# EAGLE design knobby (EAGLE 6.5.0)
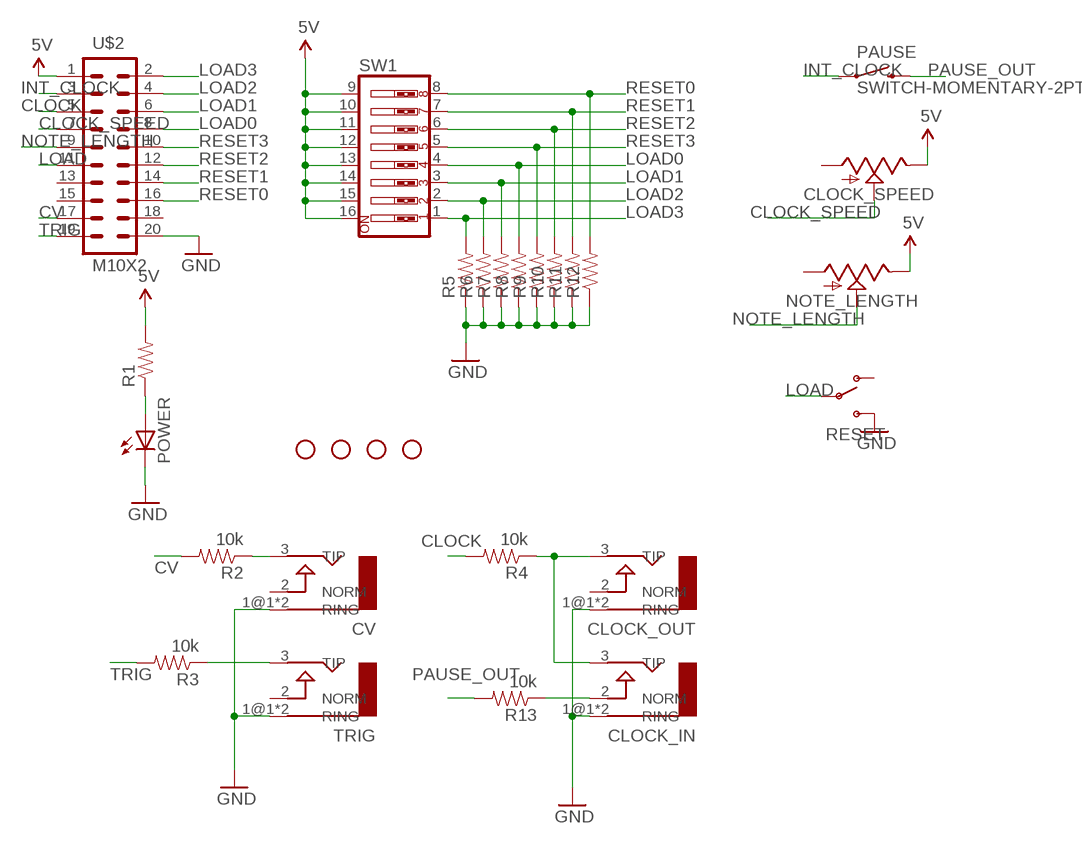
[diagram p0: schematic, sheet 1]

## Parts
CLOCK_IN  AUDIO-JACKERTHENVAR  [ERTHENVAR-JACK]
CLOCK_OUT  AUDIO-JACKERTHENVAR  [ERTHENVAR-JACK]
CLOCK_SPEED  SPARKFUN_POTPDB12  [SPARKFUN_PDB12]
CV  AUDIO-JACKERTHENVAR  [ERTHENVAR-JACK]
NOTE_LENGTH  SPARKFUN_POTPDB12  [SPARKFUN_PDB12]
PAUSE  SWITCH-MOMENTARY-2PTH  [TACTILE-PTH]
POWER  LED3MM  [LED3MM]
R1  RESISTOR0603  [0603-RES]
R2  10k  RESISTOR0603  [0603-RES]
R3  10k  RESISTOR0603  [0603-RES]
R4  10k  RESISTOR0603  [0603-RES]
R5  RESISTOR0603  [0603-RES]
R6  RESISTOR0603  [0603-RES]
R7  RESISTOR0603  [0603-RES]
R8  RESISTOR0603  [0603-RES]
R9  RESISTOR0603  [0603-RES]
R10  RESISTOR0603  [0603-RES]
R11  RESISTOR0603  [0603-RES]
R12  RESISTOR0603  [0603-RES]
R13  10k  RESISTOR0603  [0603-RES]
RESET  SWITCH-SPDTPTH  [SWITCH-SPDT]
STANDOFF1  STAND-OFF  [STAND-OFF]
STANDOFF2  STAND-OFF  [STAND-OFF]
STANDOFF3  STAND-OFF  [STAND-OFF]
STANDOFF4  STAND-OFF  [STAND-OFF]
SW1  SW_DIP-8  [DIPSWITCH-08]
TRIG  AUDIO-JACKERTHENVAR  [ERTHENVAR-JACK]
U$2  M10X2  [2X10]

## Nets
5V: CLOCK_SPEED.3(E) NOTE_LENGTH.3(E) R1.2 SW1.9 SW1.10 SW1.11 SW1.12 SW1.13 SW1.14 SW1.15 SW1.16 U$2.1
CLOCK: R4.2 U$2.5
CLOCK_SPEED: CLOCK_SPEED.2(S) U$2.7
CV: R2.2 U$2.17
GND: CLOCK_IN.1@1(RING) CLOCK_IN.1@2(RING) CLOCK_OUT.1@1(RING) CLOCK_OUT.1@2(RING) CV.1@1(RING) CV.1@2(RING) POWER.K(C) R5.1 R6.1 R7.1 R8.1 R9.1 R10.1 R11.1 R12.1 RESET.3(S) TRIG.1@1(RING) TRIG.1@2(RING) U$2.20
INT_CLOCK: PAUSE.1 U$2.3
LOAD: RESET.2(P) U$2.11
LOAD0: R8.2 SW1.4 U$2.8
LOAD1: R7.2 SW1.3 U$2.6
LOAD2: R6.2 SW1.2 U$2.4
LOAD3: R5.2 SW1.1 U$2.2
N$1: POWER.A R1.1
N$2: CV.3(TIP) R2.1
N$3: R3.1 TRIG.3(TIP)
N$4: CLOCK_IN.3(TIP) CLOCK_OUT.3(TIP) R4.1
N$5: CLOCK_IN.2(NORM) R13.1
NOTE_LENGTH: NOTE_LENGTH.2(S) U$2.9
PAUSE_OUT: PAUSE.3 R13.2
RESET0: R12.2 SW1.8 U$2.16
RESET1: R11.2 SW1.7 U$2.14
RESET2: R10.2 SW1.6 U$2.12
RESET3: R9.2 SW1.5 U$2.10
TRIG: R3.2 U$2.19
Unconnected: CLOCK_OUT.2(NORM) CLOCK_SPEED.1(A) CV.2(NORM) NOTE_LENGTH.1(A) RESET.1(O) TRIG.2(NORM) U$2.13 U$2.15 U$2.18

## Library data of the parts
CLOCK_IN CLOCK_OUT CV TRIG = erthenvar:AUDIO-JACK: Switching Mono 3.5mm Audio Jack from Erthenvar.
CLOCK_SPEED NOTE_LENGTH = DCO_PIGGY:SPARKFUN_POT
PAUSE = SparkFun-Electromechanical:SWITCH-MOMENTARY-2: Various NO switches- pushbuttons, reed, etc
POWER = SparkFun-LED:LED: LEDs Standard schematic elements and footprints for 5mm, 3mm, 1206, and 0603 sized LEDs. 5mm - Spark Fun Electronics SKU : COM-00529 (and others)
R1-R13 = SparkFun-Resistors:RESISTOR: Resistor Basic schematic elements and footprints for 0603, 1206, and PTH resistors.
RESET = SparkFun-Electromechanical:SWITCH-SPDT: SPDT Switch Simple slide switch, Spark Fun Electronics SKU : COM-00102 DPDT SMT slide switch, AYZ0202, SWCH-08179
STANDOFF1-STANDOFF4 = SparkFun-Electromechanical:STAND-OFF: #4 Stand Off This is the mechanical footprint for a #4 phillips button head screw. Use the keepout ring to avoid running the screw head into surrounding components. SKU : PRT-00447
SW1 = SparkFun-Electromechanical:SW_DIP-8: DIP Switch 8 Position Spark Fun Electronics SKU : COM-08034
U$2 = SparkFun-Connectors:M10X2: This was SPECIALLY designed to be used with our Graphic LCD Backpack. Be sure you want to use this! It is not only staggered on each line of header holes, but IT IS ALSO offset of the center point of the top and bottom lines by 5 mil. This causes the headers to lock into place on the "standard" footprint on the LCD screen. The extra squares on the tdocu layer are there simply to reference other pins (if you were to actually populate a longer header than ten long - this is what we do with the backpacks).

## Board
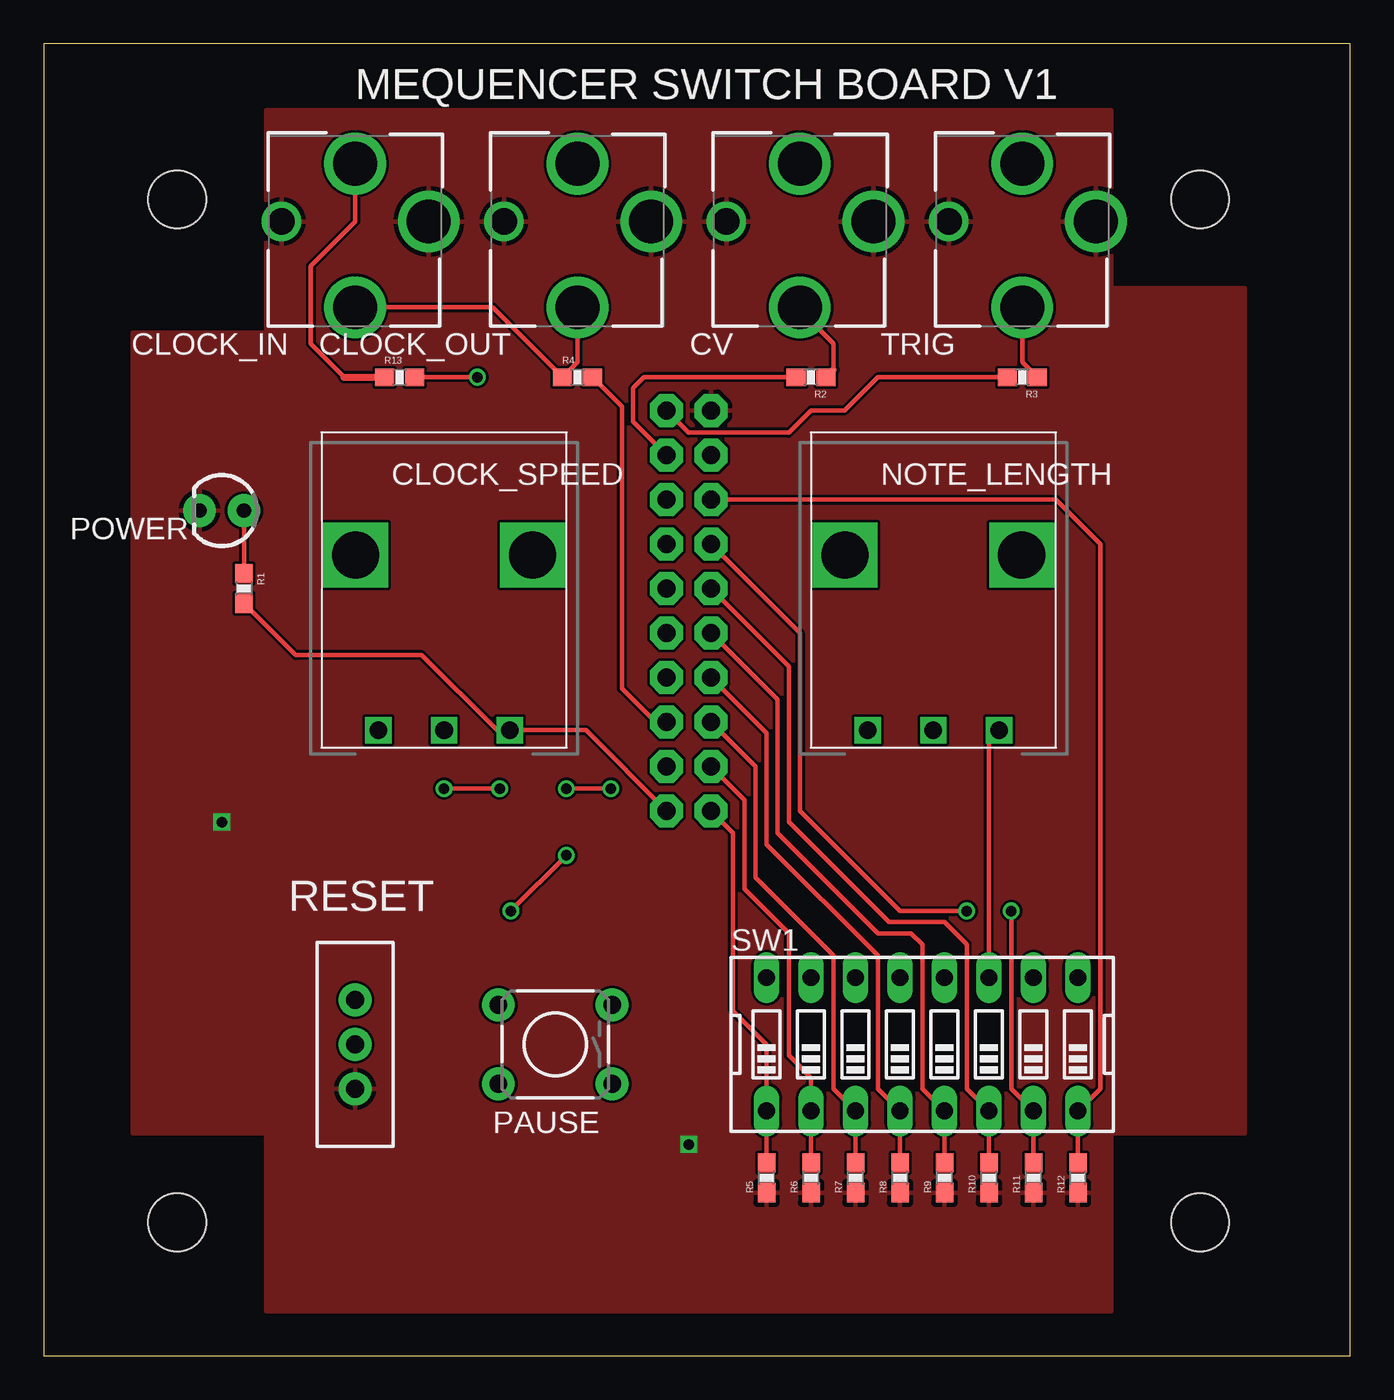
[diagram p1: board, top side]
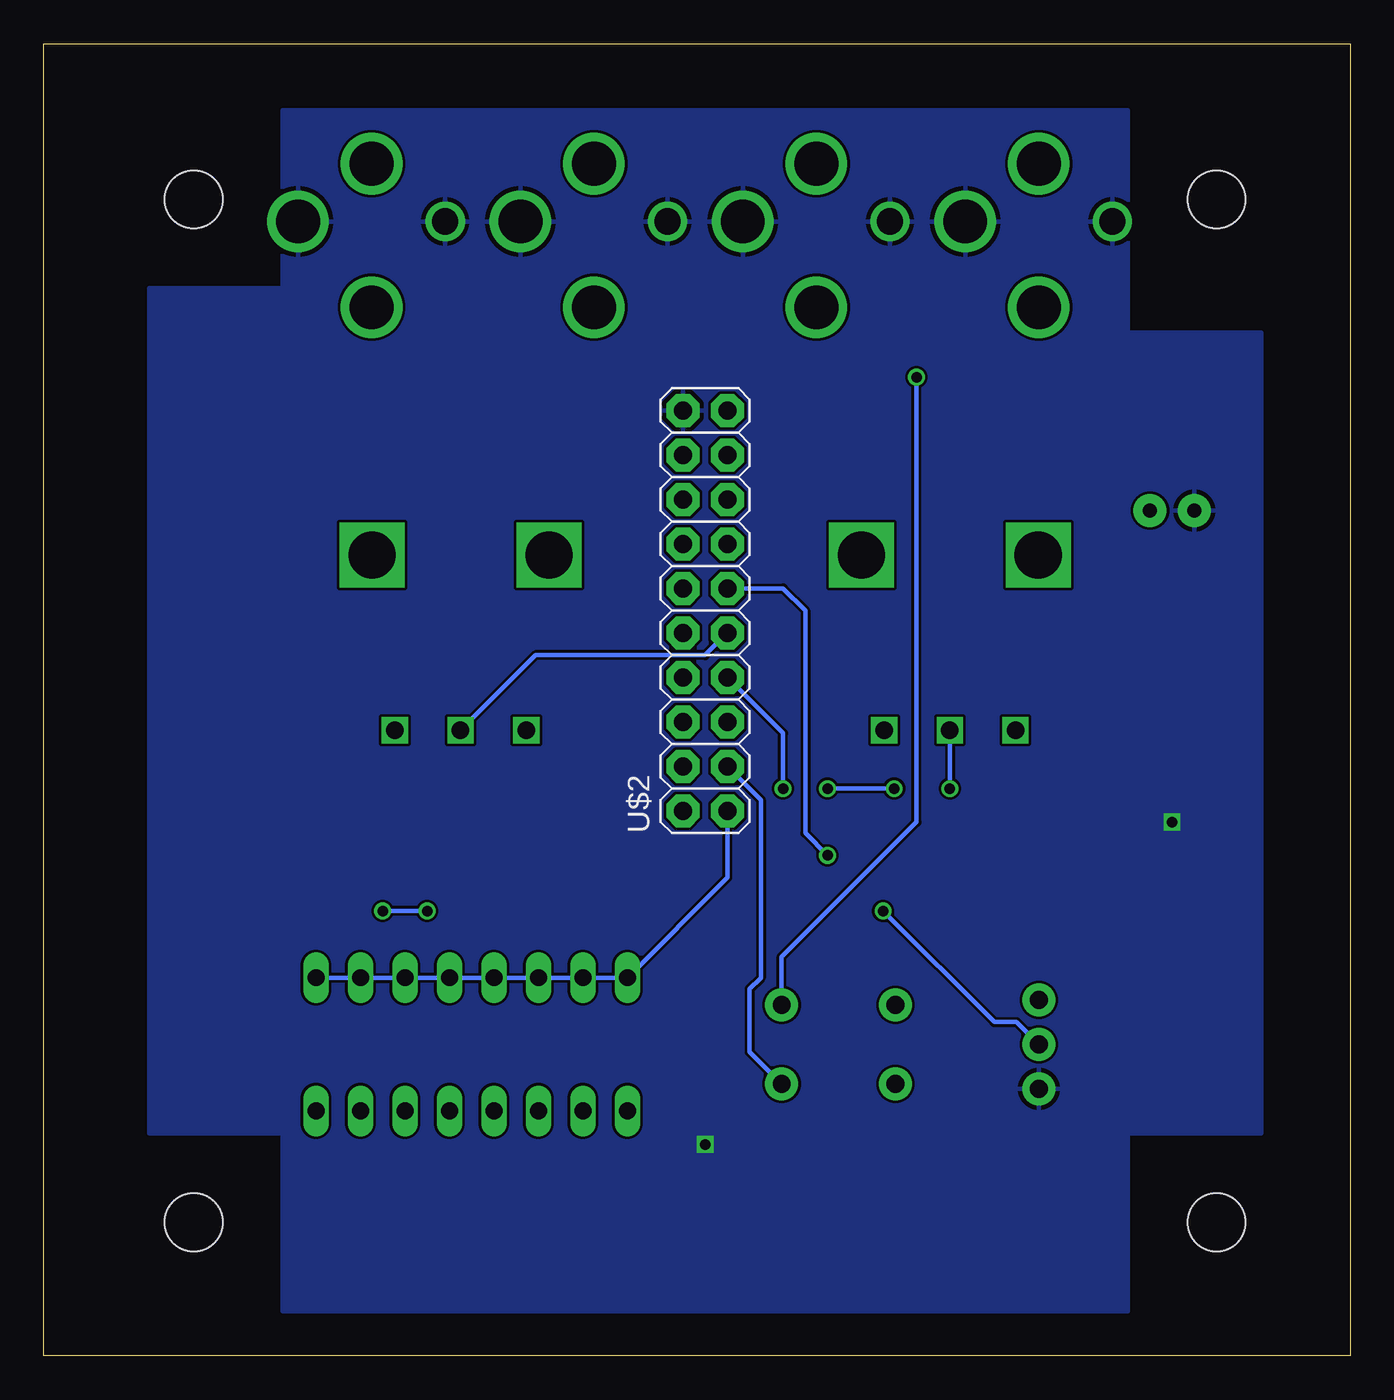
[diagram p2: board, bottom side, seen from below]

Size 74.6 x 74.92 mm. Coordinates in mm from the lower left corner, seen from the top.
Outline: 0,0 74.6,0 74.6,74.92 0,74.92 0,0
Copper layers (1*16): Top 0.0356mm / dielectric 1.5011mm / Bottom 0.0356mm
Design rules "LaenPCBOrder": minimum track width 6mil, minimum drill 13mil, track to track 6mil, track to pad 6mil, pad to pad 6mil, via to via 6mil, smd to smd 6mil, copper to edge 15mil, drill to drill 6mil, minimum pad ring 7mil, minimum via ring 7mil, stop-mask expansion 3mil, vias tented up to drill 0mil, thermal gap 10mil

### Footprints (pad centres in the part's own frame; a part is rotated, then mirrored left to right if it is on the bottom)
ERTHENVAR-JACK = drill 2.5: 1@1 -4.2,0; 2 0,-3.3; 3 0,4.9 | drill 1.5: 1@2 4.2,0
SPARKFUN_PDB12 = drill 1 square: 1 -3.75,-10; 2 0,-10; 3 3.75,-10 | drill 2.7 square: P$4 5.05,0; P$5 -5.05,0
TACTILE-PTH = drill 1.016 pad 1.88: 1 -3.251,2.261; 2 3.251,2.261; 3 -3.251,-2.261; 4 3.251,-2.261
LED3MM = drill 0.813 pad 1.88: A -1.27,0; K 1.27,0
0603-RES = smd 1.1 x 1: 1 -0.85,0; 2 0.85,0
SWITCH-SPDT = drill 1.016 pad 1.88: 1 0,2.54; 2 0,0; 3 0,-2.54
STAND-OFF = hole 3.302: 0,0
DIPSWITCH-08 = drill 0.97 long: 1 -8.89,-3.81; 2 -6.35,-3.81; 3 -3.81,-3.81; 4 -1.27,-3.81; 5 1.27,-3.81; 6 3.81,-3.81; 7 6.35,-3.81; 8 8.89,-3.81; 9 8.89,3.81; 10 6.35,3.81; 11 3.81,3.81; 12 1.27,3.81; 13 -1.27,3.81; 14 -3.81,3.81; 15 -6.35,3.81; 16 -8.89,3.81
2X10 = drill 1.016 pad 1.88 octagon: 1 -11.43,-1.27; 2 -11.43,1.27; 3 -8.89,-1.27; 4 -8.89,1.27; 5 -6.35,-1.27; 6 -6.35,1.27; 7 -3.81,-1.27; 8 -3.81,1.27; 9 -1.27,-1.27; 10 -1.27,1.27; 11 1.27,-1.27; 12 1.27,1.27; 13 3.81,-1.27; 14 3.81,1.27; 15 6.35,-1.27; 16 6.35,1.27; 17 8.89,-1.27; 18 8.89,1.27; 19 11.43,-1.27; 20 11.43,1.27

### Placement (x,y rotation side)
CLOCK_IN  17.78,64.77 180 top
CLOCK_OUT  30.48,64.77 180 top
CLOCK_SPEED  22.86,45.72 0 top
CV  43.18,64.77 180 top
NOTE_LENGTH  50.8,45.72 0 top
PAUSE  29.21,17.78 180 top
POWER  10.16,48.26 180 top
R1  11.43,43.81 270 top
R2  43.81,55.88 180 top
R3  55.88,55.88 180 top
R4  30.48,55.88 0 top
R5  41.27,10.16 90 top
R6  43.81,10.16 90 top
R7  46.35,10.16 90 top
R8  48.9,10.16 90 top
R9  51.44,10.16 90 top
R10  53.98,10.16 90 top
R11  56.52,10.16 90 top
R12  59.05,10.16 90 top
R13  20.32,55.88 0 top
RESET  17.78,17.78 0 top
STANDOFF1  7.62,66.04 0 top
STANDOFF2  66.04,66.04 0 top
STANDOFF3  66.04,7.62 0 top
STANDOFF4  7.62,7.62 0 top
SW1  50.16,17.78 0 top
TRIG  55.88,64.77 180 top
U$2  36.83,42.55 90 bottom

### Tracks (layer width: path | path; a pad name or v marks a point on that pad's centre or on a via)
5V
  Top 0.254: U$2.1 30.95,35.72 CLOCK_SPEED.3 25.88,35.72 21.59,40.01 14.39,40.01 R1.2 | SW1.11 53.98,35.15 NOTE_LENGTH.3
  Bottom 0.254: SW1.9 SW1.10 SW1.11 SW1.12 SW1.13 SW1.14 SW1.15 SW1.16 35.56,27.3 U$2.1
CLOCK
  Top 0.254: 34.92,36.2 33.02,38.1 33.02,54.19 R4.2
  Top 0.406: U$2.5 34.92,36.2
CLOCK_SPEED  (via drill 0.6)
  Top 0.254: v22.86,32.38 v26.04,32.38 | v29.84,32.38 v32.38,32.38
  Bottom 0.254: CLOCK_SPEED.2 v22.86,32.38 | v26.04,32.38 v29.84,32.38 | v32.38,32.38 32.38,35.56 U$2.7
CV
  Top 0.254: R2.2 34.29,55.88 33.66,55.24 33.66,53.34 U$2.17
GND  (via drill 0.6)
  other vias: 10.16,30.48 36.83,12.06
  pour Bottom: 60.96,2.54 60.96,12.7 68.58,12.7 68.58,60.96 60.96,60.96 60.96,71.12 12.7,71.12 12.7,58.42 5.08,58.42 5.08,12.7 12.7,12.7 12.7,2.54
  pour Top: 5.08,58.42 5.08,12.7 12.7,12.7 12.7,2.54 60.96,2.54 60.96,12.7 68.58,12.7 68.58,60.96 60.96,60.96 60.96,71.12 12.7,71.12 12.7,58.42
INT_CLOCK
  Bottom 0.254: U$2.3 33.66,31.75 33.66,21.59 34.29,20.95 34.29,17.35 PAUSE.1
LOAD  (via drill 0.6)
  Top 0.254: v29.84,28.57 v26.67,25.4
  Bottom 0.254: U$2.11 32.38,43.81 31.11,42.55 31.11,29.84 v29.84,28.57 | v26.67,25.4 20.32,19.05 19.05,19.05 RESET.2
LOAD0
  Top 0.254: R8.2 SW1.4 47.62,15.24 47.62,22.86 41.27,29.21 41.27,35.56 U$2.8
LOAD1
  Top 0.254: R7.2 SW1.3 45.09,15.24 45.09,22.86 40.64,27.3 40.64,33.66 U$2.6
LOAD2
  Top 0.254: R6.2 SW1.2 43.81,15.88 42.55,17.14 42.55,24.13 40.01,26.67 40.01,31.75 U$2.4
LOAD3
  Top 0.254: R5.2 SW1.1 41.27,17.78 39.37,19.68 39.37,29.84 U$2.2
N$1
  Top 0.254: R1.1 POWER.A
N$2
  Top 0.254: CV.3 43.18,59.69 45.09,57.78 45.09,56.3
  Top 0.406: 45.09,56.3 R2.1
N$3
  Top 0.254: TRIG.3 55.88,56.73 R3.1
N$4
  Top 0.254: CLOCK_OUT.3 30.48,56.73 R4.1 25.64,59.87 CLOCK_IN.3
N$5
  Top 0.254: CLOCK_IN.2 17.78,64.77 15.24,62.23 15.24,57.78 17.14,55.88
  Top 0.406: 17.14,55.88 R13.1
NOTE_LENGTH
  Bottom 0.254: U$2.9 36.83,40.01 46.52,40.01 NOTE_LENGTH.2
PAUSE_OUT  (via drill 0.6)
  Top 0.254: v24.77,55.88 R13.2
  Bottom 0.254: PAUSE.3 32.46,22.78 24.77,30.48 v24.77,55.88
RESET0
  Top 0.254: R12.2 SW1.8 60.33,15.24 60.33,46.35 57.78,48.9 U$2.16
RESET1  (via drill 0.6)
  Top 0.254: R11.2 SW1.7 55.24,15.24 v55.24,25.4 | U$2.14 43.18,41.27 43.18,31.11 48.9,25.4 v52.7,25.4
  Bottom 0.254: v52.7,25.4 v55.24,25.4
RESET2
  Top 0.254: R10.2 SW1.6 52.7,15.24 52.7,23.5 51.44,24.77 48.26,24.77 42.55,30.48 42.55,39.37 U$2.12
RESET3
  Top 0.254: R9.2 SW1.5 50.16,15.24 50.16,23.5 49.53,24.13 47.62,24.13 41.91,29.84 41.91,37.47 U$2.10
TRIG
  Top 0.254: R3.2 47.62,55.88 45.72,53.98 43.81,53.98 42.55,52.7 36.83,52.7 U$2.19

### Text on the board
tNames: MEQUENCER SWITCH BOARD V1